# Altium schematic sheet 16-AM64x-05.SchDoc
size B; SheetNumber: 16; SheetTotal: 25
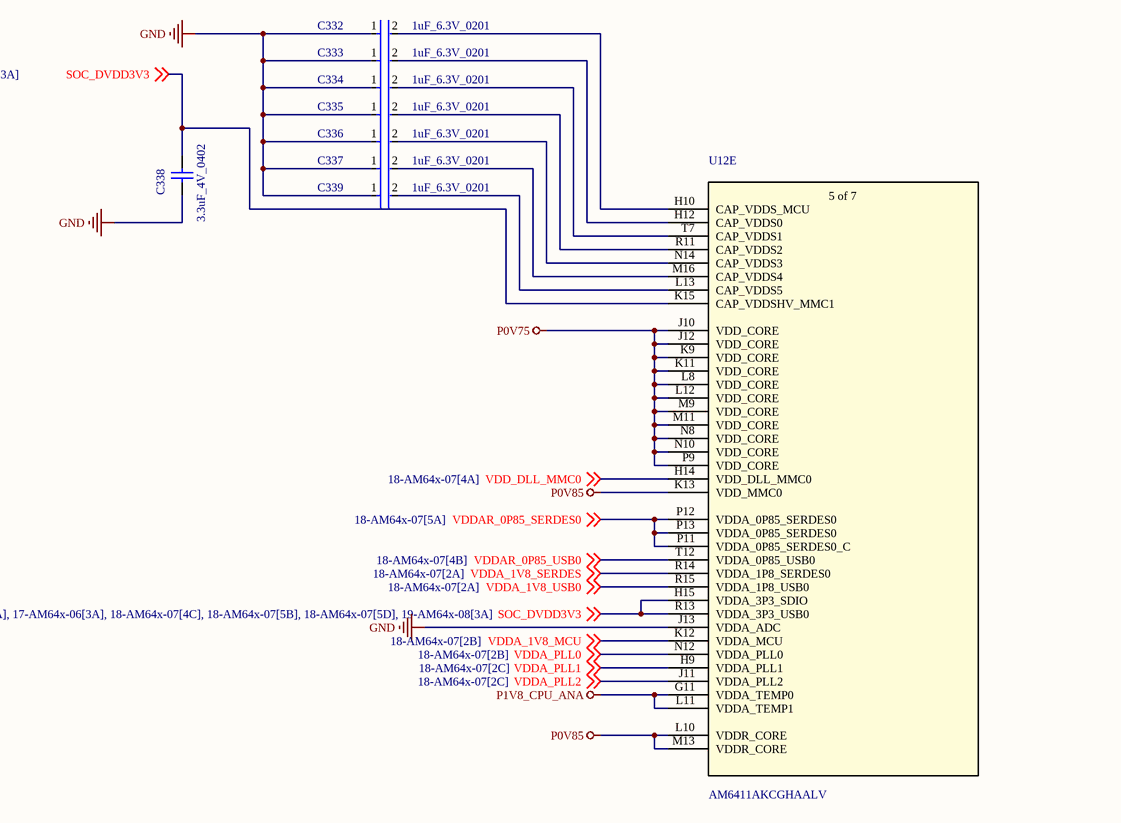
[diagram p0: 16-AM64x-05.SchDoc]

## Parts
C332  1uF_6.3V_0201  [FP-CL03-IPC_B]
C333  1uF_6.3V_0201  [FP-CL03-IPC_B]
C334  1uF_6.3V_0201  [FP-CL03-IPC_B]
C335  1uF_6.3V_0201  [FP-CL03-IPC_B]
C336  1uF_6.3V_0201  [FP-CL03-IPC_B]
C337  1uF_6.3V_0201  [FP-CL03-IPC_B]
C338  3.3uF_4V_0402  [CAPC1005X60X30LL05T10]
C339  1uF_6.3V_0201  [FP-CL03-IPC_B]
U12  AM6411AKCGHAALV  [FCBGA441_ALV_TEX]  (part E of 7)

## Nets
GND: C332.1 C333.1 C334.1 C335.1 C336.1 C337.1 C338.1 C339.1 U12.J13(VDDA_ADC)
P0V75: U12.J10(VDD_CORE) U12.J12(VDD_CORE) U12.K9(VDD_CORE) U12.K11(VDD_CORE) U12.L8(VDD_CORE) U12.L12(VDD_CORE) U12.M9(VDD_CORE) U12.M11(VDD_CORE) U12.N8(VDD_CORE) U12.N10(VDD_CORE) U12.P9(VDD_CORE)
P0V85: U12.K13(VDD_MMC0) U12.L10(VDDR_CORE) U12.M13(VDDR_CORE)
P1V8_CPU_ANA: U12.G11(VDDA_TEMP0) U12.L11(VDDA_TEMP1)
SOC_DVDD3V3: C338.2 U12.H15(VDDA_3P3_SDIO) U12.K15(CAP_VDDSHV_MMC1) U12.R13(VDDA_3P3_USB0) ; off-sheet SOC_DVDD3V3
VDD_DLL_MMC0: U12.H14(VDD_DLL_MMC0) ; off-sheet VDD_DLL_MMC0
VDDA_1V8_MCU: U12.K12(VDDA_MCU) ; off-sheet VDDA_1V8_MCU
VDDA_1V8_SERDES: U12.R14(VDDA_1P8_SERDES0) ; off-sheet VDDA_1V8_SERDES
VDDA_1V8_USB0: U12.R15(VDDA_1P8_USB0) ; off-sheet VDDA_1V8_USB0
VDDA_PLL0: U12.N12(VDDA_PLL0) ; off-sheet VDDA_PLL0
VDDA_PLL1: U12.H9(VDDA_PLL1) ; off-sheet VDDA_PLL1
VDDA_PLL2: U12.J11(VDDA_PLL2) ; off-sheet VDDA_PLL2
VDDAR_0P85_SERDES0: U12.P11(VDDA_0P85_SERDES0_C) U12.P12(VDDA_0P85_SERDES0) U12.P13(VDDA_0P85_SERDES0) ; off-sheet VDDAR_0P85_SERDES0
VDDAR_0P85_USB0: U12.T12(VDDA_0P85_USB0) ; off-sheet VDDAR_0P85_USB0
NetC332_2: C332.2 U12.H10(CAP_VDDS_MCU)
NetC333_2: C333.2 U12.H12(CAP_VDDS0)
NetC334_2: C334.2 U12.T7(CAP_VDDS1)
NetC335_2: C335.2 U12.R11(CAP_VDDS2)
NetC336_2: C336.2 U12.N14(CAP_VDDS3)
NetC337_2: C337.2 U12.M16(CAP_VDDS4)
NetC339_2: C339.2 U12.L13(CAP_VDDS5)

## Notes on the sheet
- (in symbol AM6411AKCGHAALV, part E) 5 of 7

## Library data of the parts
C332-C337 C339 = CMP-13271-002789-1: Cap Ceramic 1uF 6.3V X5R ±20% Pad SMD 0201 +85°C T/R; Tolerance: 20%; Voltage Rating: 6.3V; Mount: Surface Mount; Min Operating Temperature: -55°C; Package Quantity: 15000; Max Operating Temperature: 85°C; Height: 0.3mm; Packaging: Tape and Reel; Thickness: 0.013inch; Dielectric: X5R; Case/Package: 0201; Case Code (Imperial): 0201; Radiation Hardening: No; Case Code (Metric): 0603; Capacitance: 1uF; Width: 0.012inch; Depth: 0.3mm; Length: 0.6mm
C338 = CMP-1034-02130-2: Part Number: C0402C335M7PACTU; Manufacturer: Kemet
U12 = AM6411AKCGHAALV: No Description Available; Mfr_Name: Texas Instruments; RefDes: RefDes; Type: Type